# EasyEDA Pro project ProPrj_智能视觉集成板-V1.0.epro, board PCB5
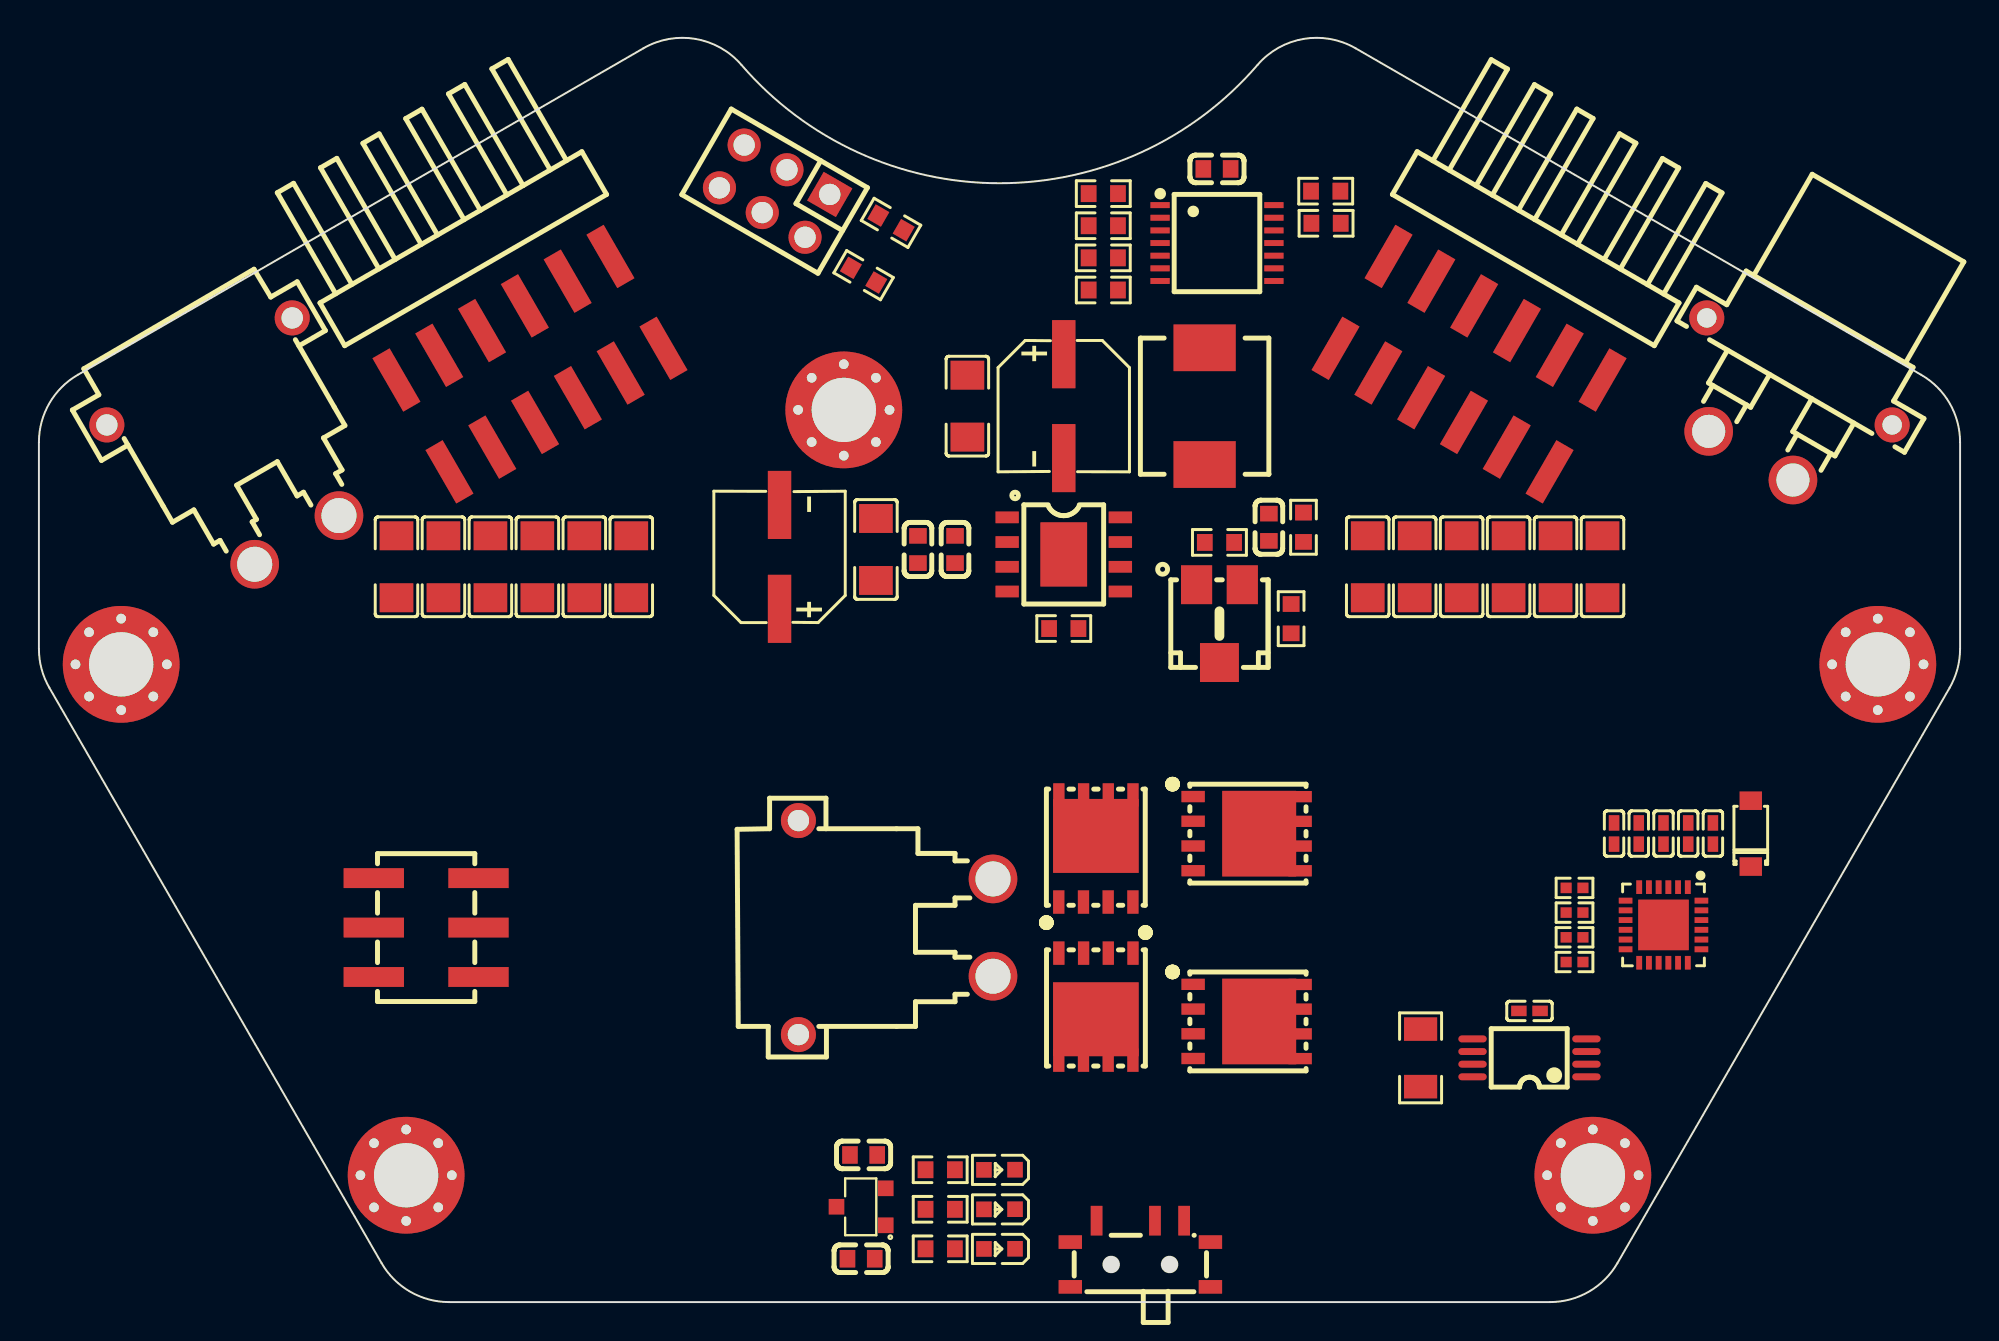
[diagram p14: board, top side]
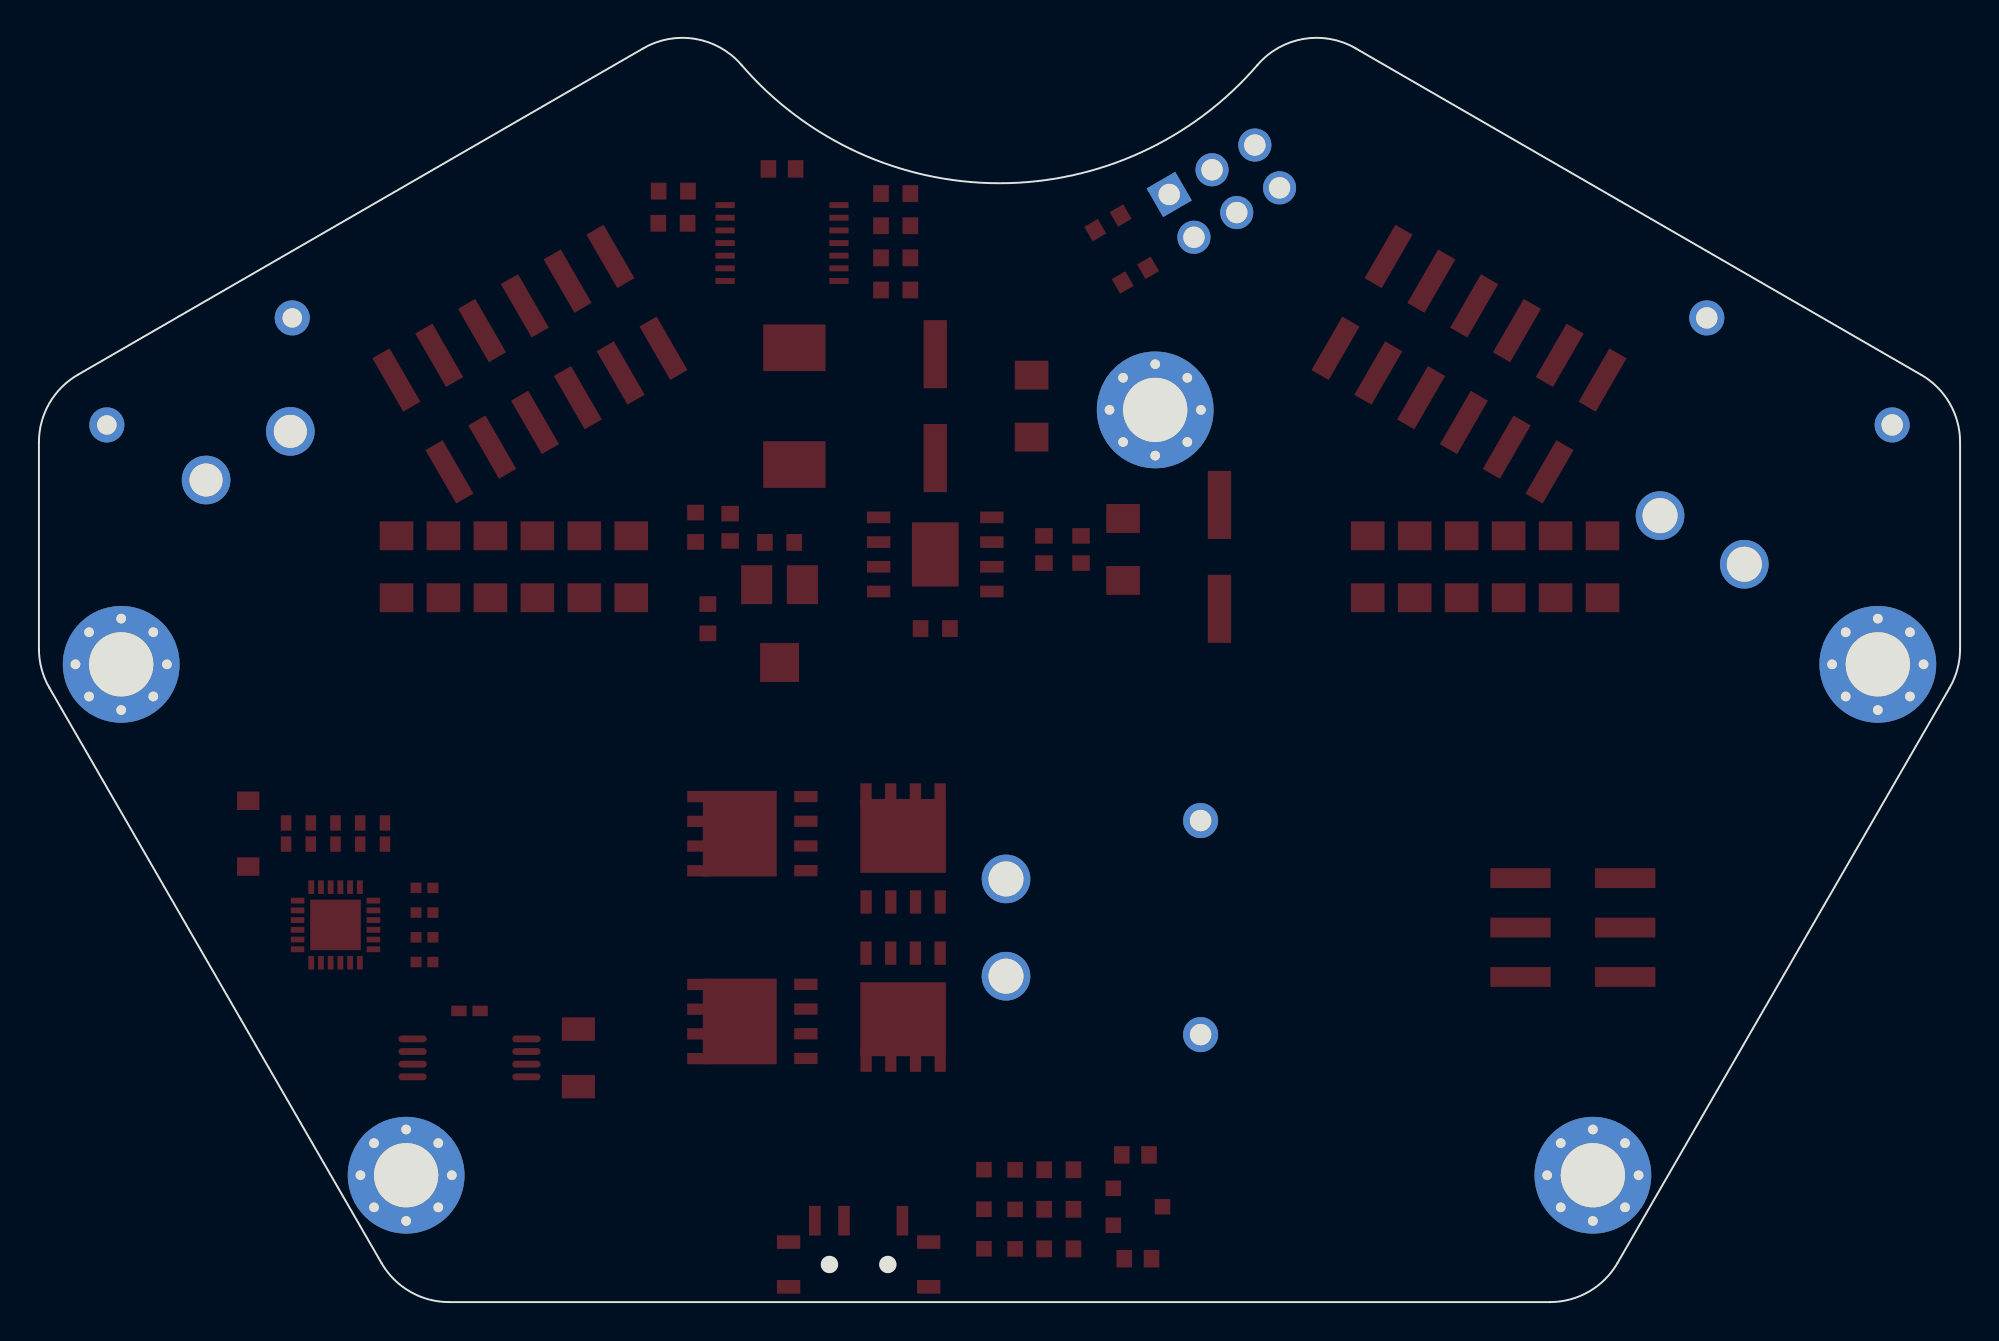
[diagram p15: board, bottom side, seen from below]

Outline 98.73 x 64.92 mm; copper layers: Top Layer, Bottom Layer. Coordinates in mm from the lower left corner of the outline.
Outline path: 0,44.19 0,33.57 arc(0.14,32.54) 0.54,31.57 17.61,2 arc(19.07,0.54) 21.07,0 77.65,0 arc(79.65,0.54) 81.12,2 98.19,31.57 arc(98.59,32.54) 98.73,33.57 98.73,44.19 arc(98.19,46.19) 96.73,47.66 67.66,64.44 arc(64.99,64.92) 62.63,63.58 arc(49.36,57.5) 36.1,63.58 arc(33.74,64.92) 31.07,64.44 2,47.66 arc(0.54,46.19) 0,44.19
Stack: Top Layer 0.035mm / Dielectric1 1.51mm FR4 er 4.5 / Bottom Layer 0.035mm

## Design rules (mm)
template: JLCPCB Capability(Two Layers Board)
spacing copperThickness1oz (default): track to track 0.102, other pairs 0.152 to 0.3
spacing copperThickness2oz: track to track 0.203, other pairs 0.152 to 0.3
track width copperThickness1oz (default): min 0.127, default 0.254, max 2.54
track width copperThickness2oz: min 0.203, default 0.254, max 2.54
differential pair differentialPair (default): width min 0.127, default 0.254, max 2.54; gap min 0.152, default 0.152
via viaSize (default): diameter min 0.5, default 0.61, max 10; hole min 0.3, default 0.305, max 6.3

## Placement (name value [footprint] x y rotation side)
C44  1nF  [C0603]  42.25 2.23 180 top
C45  1nF  [C0603]  42.38 7.56 0 top
C86  100nF  [C0603]  45.17 38.68 270 top
C88  100nF  [C0603]  47.08 38.68 90 top
C90  4.7nF  [C0603]  63.21 39.82 90 top
C94  22uF  [c1206]  75.53 37.79 270 top
C95  22uF  [c1206]  73.11 37.79 270 top
C96  22uF  [c1206]  70.7 37.79 270 top
C97  22uF  [c1206]  68.29 37.79 270 top
C120  100nF  [C0402]  84.76 24.08 270 top
C121  100nF  [C0402]  86.03 24.08 270 top
C122  100nF  [C0402]  83.49 24.08 270 top
C126  1uF  [C0402]  82.22 24.08 270 top
C127  1uF  [C0402]  80.95 24.08 90 top
C130  100nF  [C0402]  76.6 14.96 0 top
C132  100nF  [C0603]  60.54 58.24 0 top
C133  22uF  [c1206]  80.35 37.79 270 top
C134  22uF  [c1206]  77.94 37.79 270 top
C135  22uF  [c1206]  30.44 37.79 270 top
C136  22uF  [c1206]  28.03 37.79 270 top
C137  22uF  [c1206]  25.61 37.79 270 top
C138  22uF  [c1206]  23.2 37.79 270 top
C139  22uF  [c1206]  20.79 37.79 270 top
C142  22uF  [c1206]  18.38 37.79 270 top
C145  220uF  [CAP-SMD_BD6.3-L6.6-W6.6-LS7.8-FD]  38.06 38.3 90 top
C146  220uF  [CAP-SMD_BD6.3-L6.6-W6.6-LS7.8-FD]  52.67 46.04 270 top
C147  4.7uF  [c1206]  43.01 38.68 270 top
C148  47uF  [c1206]  47.71 46.04 90 top
CN6  XT30PW-M30.G.Y  [CONN-TH_XT30PW-M]  10.75 43.5 210 top
CN12  XT30PW-M30.G.Y  [CONN-TH_XT30PW-M]  44.03 19.25 270 top
D28  B5819W  [SOD-123_L2.8-W1.8-LS3.7-RD]  87.97 24.07 90 top
H3  PZ254V-12-6P  [HDR-TH_6P-P2.54-V-M-R2-C3-S2.54]  37.81 57.09 150 top
J1  -  [M3螺帽]  18.87 6.52 0 top
J3  -  [M3螺帽]  41.36 45.85 0 top
J4  -  [M3螺帽]  79.86 6.52 0 top
J5  -  [M3螺帽]  94.5 32.78 0 top
J6  -  [M3螺帽]  4.23 32.78 0 top
L7  4.7uH  [IND-SMD_L7.0-W6.6]  59.9 46.04 90 top
LED4  NCD0603R1  [LED0603-RD_RED]  49.36 6.8 180 top
LED5  NCD0603R1  [LED0603-RD_RED]  49.36 2.74 180 top
LED7  NCD0603R1  [LED0603-RD_RED]  49.36 4.77 180 top
Q21  IRFH7440TRPBF  [DFN-8_L5.8-W4.9-P1.27-LS6.0-BL-1]  62.06 24.07 270 top
Q22  IRFH7440TRPBF  [DFN-8_L5.8-W4.9-P1.27-LS6.0-BL-1]  54.32 23.31 0 top
Q23  IRFH7440TRPBF  [DFN-8_L5.8-W4.9-P1.27-LS6.0-BL-1]  62.06 14.42 270 top
Q24  IRFH7440TRPBF  [DFN-8_L5.8-W4.9-P1.27-LS6.0-BL-1]  54.32 15.18 180 top
R68  2.2K  [R0603]  46.32 6.8 180 top
R69  2.2K  [R0603]  46.32 2.74 180 top
R89  100R  [R0603]  54.7 56.97 180 top
R90  100R  [R0603]  54.7 52.01 180 top
R132  200K  [R0603]  52.67 34.61 180 top
R133  27K  [R0603]  64.35 35.12 90 top
R135  8.2K  [R0603]  64.98 39.82 270 top
R136  10K  [R0603]  46.32 4.77 180 top
R137  20K  [R0603]  60.67 39.04 0 top
R138  50kΩ  [RES-ADJ-TH_3P-L5.0-W4.5-P2.35-BR]  60.67 34.87 180 top
R161  10kΩ  [R0402]  78.91 21.29 0 top
R162  10kΩ  [R0402]  78.91 20.02 0 top
R165  1kΩ  [R0402]  78.91 18.75 0 top
R168  33kΩ  [R0402]  78.91 17.48 0 top
R173  10kΩ  [R0603]  54.7 53.66 0 top
R174  10kΩ  [R0603]  54.7 55.31 0 top
R175  10kΩ  [R0603]  66.14 55.44 180 top
R176  10kΩ  [R0603]  66.13 57.09 180 top
R177  100Ω  [R0603]  43.79 55.46 150 top
R178  100Ω  [R0603]  42.38 52.78 330 top
SW4  MSK12C02  [SW-TH_MSK12C02]  56.6 2.48 0 top
U10  LR8341A-T33  [SOT-23-3L_L2.9-W1.6-P1.90-LS2.8-BL]  42.25 4.9 90 top
U11  SN74HC125PWR  [TSSOP-14_L5.0-W4.4-P0.65-LS6.5-BL]  60.54 54.43 270 top
U37  100mΩ  [R1206]  71 12.55 90 top
U39  DRV8701ERGER  [VQFN-24_L4.0-W4.0-P0.50-BL-EP2.5]  83.49 19.38 180 top
U41  INA240A2PWR  [TSSOP-8_L4.4-W3.0-P0.65-LS6.4-BL]  76.6 12.55 90 top
U56  XT30PW-F20.G.Y  [CONN-TH_XT30PW-F-1]  89.22 45.66 150 top
U57  PZ254-2-06-WS  [HDR-SMD_12P-P2.54_HCTL_PZ254-2-06-WS]  73.49 48.2 150 top
U58  PZ254-2-06-WS  [HDR-SMD_12P-P2.54_HCTL_PZ254-2-06-WS]  25.23 48.2 210 top
U59  SCT2450STER  [ESOP-8_L4.9-W3.9-P1.27-LS6.0-BL-EP]  52.67 38.42 270 top
编码器1  PZ254-2-03-S  [HDR-SMD_6P-P2.54-V-M-R2-C3-LS7.5-2]  19.9 19.25 270 top

## Footprints (pads in the part's own frame, mm; a bottom-side part is the same pattern mirrored in y, then rotated)
C0402
  rect 0.79x0.54 smd: 1(-0.545,0) 2(0.545,0)
C0603
  rect 0.8x0.9 smd: 1(-0.7,0) 2(0.7,0)
c1206
  rect 1.485x1.728 smd: 1(-1.593,0) 2(1.593,0)
CAP-SMD_BD6.3-L6.6-W6.6-LS7.8-FD
  rect 3.5x1.2 smd: 1(-2.67,0) 2(2.67,0)
CONN-TH_XT30PW-F-1
  round 2.5 hole 1.7: 1(-2.5,2.5) 2(2.5,2.5)
  round 1.8 hole 1: 3(5.5,-2.5) 4(-5.5,-2.5)
CONN-TH_XT30PW-M
  round 2.5 hole 1.8: 1(-2.5,5) 2(2.5,5)
  round 1.8 hole 1.1: 3(5.5,-5) 4(-5.5,-5)
DFN-8_L5.8-W4.9-P1.27-LS6.0-BL-1
  rect 0.58x1.2 smd: 1(-1.907,-2.75) 2(-0.637,-2.75) 3(0.632,-2.75) 4(1.903,-2.75) 5(1.907,2.75) 6(0.637,2.75) 7(-0.632,2.75) 8(-1.903,2.75)
  rect 4.4x3.8 smd: 9(0,0.646)
ESOP-8_L4.9-W3.9-P1.27-LS6.0-BL-EP
  rect 0.6x1.2 smd: 1(-1.905,-2.909) 2(-0.635,-2.909) 3(0.635,-2.909) 4(1.905,-2.909) 5(1.905,2.909) 6(0.635,2.909) 7(-0.635,2.909) 8(-1.905,2.909)
  rect 3.3x2.4 smd: 9(0,0)
HDR-SMD_6P-P2.54-V-M-R2-C3-LS7.5-2
  rect 1.02x3.1 smd: 1(-2.54,-2.69) 2(-2.54,2.69) 3(0,-2.69) 4(0,2.69) 5(2.54,-2.69) 6(2.54,2.69)
HDR-SMD_12P-P2.54_HCTL_PZ254-2-06-WS
  rect 1.02x3.17 smd: 1(-6.35,-2.725) 2(-6.35,2.725) 3(-3.81,-2.725) 4(-3.81,2.725) 5(-1.27,-2.725) 6(-1.27,2.725) 7(1.27,-2.725) 8(1.27,2.725) 9(3.81,-2.725) 10(3.81,2.725) 11(6.35,-2.725) 12(6.35,2.725)
HDR-TH_6P-P2.54-V-M-R2-C3-S2.54
  rect 1.7x1.7 hole 1.1: 1(-2.54,-1.27)
  round 1.7 hole 1.1: 2(-2.54,1.27) 3(0,-1.27) 4(0,1.27) 5(2.54,-1.27) 6(2.54,1.27)
IND-SMD_L7.0-W6.6
  rect 2.4x3.2 smd: 1(-3,0) 2(3,0)
LED0603-RD_RED
  rect 0.8x0.8 smd: 1(-0.799,-0.004) 2(0.799,0.004)
M3螺帽
  round 6 hole 3.302: 1(0,0)
  round 1 hole 0.5: 2(0,2.349) 3(0,-2.349) 4(2.349,0) 5(-2.349,0) 6(1.651,1.651) 7(-1.651,-1.651) 8(1.651,-1.651) 9(-1.651,1.651)
R0402
  rect 0.566x0.54 smd: 1(-0.433,0) 2(0.433,0)
R0603
  rect 0.806x0.864 smd: 1(-0.753,0) 2(0.753,0)
R1206
  rect 1.208x1.701 smd: 1(-1.479,0) 2(1.479,0)
RES-ADJ-TH_3P-L5.0-W4.5-P2.35-BR
  rect 1.6x2 smd: 1(1.175,-2) 3(-1.175,-2)
  rect 2x2 smd: 2(0,2)
SOD-123_L2.8-W1.8-LS3.7-RD
  rect 0.95x1.15 smd: 1(-1.692,0) 2(1.692,0)
SOT-23-3L_L2.9-W1.6-P1.90-LS2.8-BL
  rect 0.8x0.8 smd: 1(-0.95,-1.265) 2(0.95,-1.265) 3(0.005,1.265)
SW-TH_MSK12C02
  rect 0.6x1.524 smd: 1(-2.25,1.7) 2(0.75,1.7) 3(2.25,1.7)
  rect 1.2x0.7 smd: 4(-3.6,0.6) 4(-3.6,-1.7) 4(3.6,0.6) 4(3.6,-1.7)
TSSOP-8_L4.4-W3.0-P0.65-LS6.4-BL
  oval 0.353x1.454 smd: 1(-0.975,-2.927) 2(-0.325,-2.927) 3(0.325,-2.927) 4(0.975,-2.927) 5(0.975,2.927) 6(0.325,2.927) 7(-0.325,2.927) 8(-0.975,2.927)
TSSOP-14_L5.0-W4.4-P0.65-LS6.5-BL
  rect 0.305x0.991 smd: 1(-1.95,-2.925) 2(-1.3,-2.925) 3(-0.65,-2.925) 4(0,-2.925) 5(0.65,-2.925) 6(1.3,-2.925) 7(1.95,-2.925) 8(1.95,2.925) 9(1.3,2.925) 10(0.65,2.925) 11(0,2.925) 12(-0.65,2.925) 13(-1.3,2.925) 14(-1.95,2.925)
VQFN-24_L4.0-W4.0-P0.50-BL-EP2.5
  rect 0.3x0.7 smd: 1(-1.25,-1.942) 2(-0.75,-1.942) 3(-0.25,-1.942) 4(0.25,-1.942) 5(0.75,-1.942) 6(1.25,-1.942) 13(1.25,1.942) 14(0.75,1.942) 15(0.25,1.942) 16(-0.25,1.942) 17(-0.75,1.942) 18(-1.25,1.942)
  rect 0.7x0.3 smd: 7(1.948,-1.25) 8(1.948,-0.75) 9(1.948,-0.25) 10(1.948,0.25) 11(1.948,0.75) 12(1.948,1.25) 19(-1.948,1.25) 20(-1.948,0.75) 21(-1.948,0.25) 22(-1.948,-0.25) 23(-1.948,-0.75) 24(-1.948,-1.25)
  rect 2.6x2.6 smd: 25(0.001,-0.001)

## Nets
+3V3: C45.2 R68.2 SW4.2 U10.2
AVDD_1: C126.2 R165.1 U39.6 U39.7
DVDD_1: C127.2 C132.2 R161.1 R162.1 U11.14 U39.8
GND_MOTO: C44.1 C45.1 C86.1 C90.2 C94.1 C95.1 C96.1 C97.1 C120.1 C126.1 C127.1 C132.1 C133.1 C134.1 C135.1 C136.1 C137.1 C138.1 C139.1 C142.1 C145.2 C146.2 C147.1 C148.1 CN6.1 H3.5 H3.6 LED4.1 LED5.1 LED7.1 R132.1 R135.1 R168.1 R173.1 R174.1 R175.1 R176.1 U10.1 U11.1 U11.4 U11.7 U11.10 U11.13 U37.2 U39.5 U39.16 U39.20 U39.25 U41.3 U56.2 U57.8 U58.6 U59.7 U59.9
GND_PRO: U41.1 U41.7 U57.4 U57.10 U58.4 U58.10 编码器1.1
VCC_3V3: U57.3 U57.9 U58.3 U58.9 编码器1.2
VCC_BAT: C86.2 C94.2 C95.2 C96.2 C97.2 C133.2 C134.2 C135.2 C136.2 C137.2 C138.2 C139.2 C142.2 C145.1 C147.2 CN6.2 D28.2 Q21.5 Q21.6 Q21.7 Q21.8 Q21.9 Q23.5 Q23.6 Q23.7 Q23.8 Q23.9 U56.1 U57.7 U58.5 U59.2 U59.3
VCC_SERVO: C146.1 C148.2 H3.3 H3.4 L7.2 R133.2 R136.2
VCCBAT: C44.2 U10.3
EN-IN_1: R90.1 R173.2 U11.5
EN_1: U11.6 U39.14
ENCODER_DIR: U57.6 U58.8 编码器1.4
ENCODER_STL: U57.5 U58.7 编码器1.3
ENIN_1: R90.2 U57.2 U58.12
GH1_1: Q23.4 U39.17
GH2_1: Q21.4 U39.24
GL1_1: Q24.4 U39.19
GL2_1: Q22.4 U39.22
I_OUT_R: U41.8
NSLEEP: R69.2 SW4.3 U39.13
PH-IN_1: R89.1 R174.2 U11.2
PH_1: U11.3 U39.15
PHIN_1: R89.2 U57.1 U58.11
SERVO_1: R177.1 U57.11 U58.1
SERVO_2: R178.2 U57.12 U58.2
SH1_1: CN12.2 Q23.1 Q23.2 Q23.3 Q24.5 Q24.6 Q24.7 Q24.8 Q24.9 U39.18
SH2_1: CN12.1 Q21.1 Q21.2 Q21.3 Q22.5 Q22.6 Q22.7 Q22.8 Q22.9 U39.23
SP_1: Q22.1 Q22.2 Q22.3 Q24.1 Q24.2 Q24.3 U37.1 U39.21 U41.2
$1N726: J3.1
$1N728: J1.1
$1N729: J4.1
$1N730: J5.1
$1N731: J6.1
$2N2538: R161.2 U39.9
$2N2539: R162.2 U39.10
$2N2543: C120.2 C121.1 D28.1 U39.1
$2N2544: C121.2 U39.2
$2N2545: C122.1 U39.3
$2N2549: R165.2 R168.2 U39.12
$2N2590: C122.2 U39.4
$2N2594: LED4.2 R68.1
$2N2595: LED5.2 R69.1
$2N2609: R176.2 U11.12
$2N2610: R175.2 U11.9
$2N2632: C130.1 U41.5 U41.6
$2N2649: C130.2 U41.4
$3N1747: C90.1 R137.2
$3N1748: R137.1 U59.6
$3N1749: C88.1 U59.1
$3N1751: R135.2 R138.1 U59.5
$3N1752: C88.2 L7.1 U59.8
$3N1753: LED7.2 R136.1
$3N1755: R133.1 R138.2 R138.3
$3N1758: H3.1 R177.2
$3N1763: H3.2 R178.1
$3N1766: R132.2 U59.4

Pads without a net: CN6 3 4; CN12 3 4; J1 2 3 4 5 6 7 8 9; J3 2 3 4 5 6 7 8 9; J4 2 3 4 5 6 7 8 9; J5 2 3 4 5 6 7 8 9; J6 2 3 4 5 6 7 8 9; SW4 1 4; U11 8 11; U39 11; U56 3 4; 编码器1 5 6
